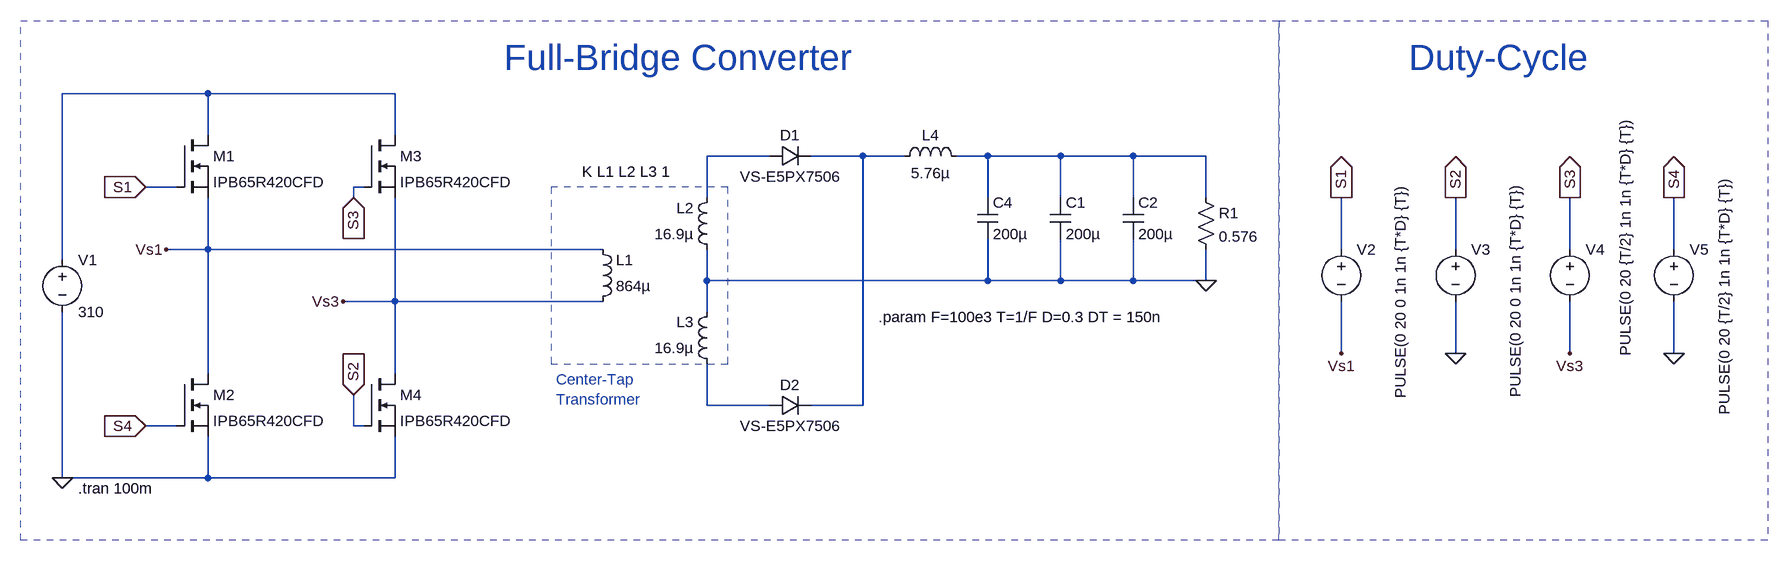
[diagram p0: schematic full_bridge_v1.asc]
full_bridge_v1.asc, the LTspice schematic file:
Version 4.1
SHEET 1 2740 680
WIRE 336 -464 112 -464
WIRE 624 -464 336 -464
WIRE 336 -400 336 -464
WIRE 624 -400 624 -464
WIRE 1200 -368 1104 -368
WIRE 1344 -368 1264 -368
WIRE 1408 -368 1344 -368
WIRE 1536 -368 1488 -368
WIRE 1648 -368 1536 -368
WIRE 1760 -368 1648 -368
WIRE 1872 -368 1760 -368
WIRE 288 -320 240 -320
WIRE 576 -320 560 -320
WIRE 560 -304 560 -320
WIRE 1104 -304 1104 -368
WIRE 1536 -304 1536 -368
WIRE 1648 -304 1648 -368
WIRE 1760 -304 1760 -368
WIRE 1872 -304 1872 -368
WIRE 336 -224 336 -304
WIRE 336 -224 272 -224
WIRE 944 -224 336 -224
WIRE 2080 -224 2080 -304
WIRE 2256 -224 2256 -304
WIRE 2432 -224 2432 -304
WIRE 2592 -224 2592 -304
WIRE 112 -208 112 -464
WIRE 1104 -176 1104 -224
WIRE 1536 -176 1536 -240
WIRE 1536 -176 1104 -176
WIRE 1648 -176 1648 -240
WIRE 1648 -176 1536 -176
WIRE 1760 -176 1760 -240
WIRE 1760 -176 1648 -176
WIRE 1872 -176 1872 -224
WIRE 1872 -176 1760 -176
WIRE 624 -144 624 -304
WIRE 624 -144 544 -144
WIRE 944 -144 624 -144
WIRE 1104 -128 1104 -176
WIRE 2080 -64 2080 -144
WIRE 2256 -64 2256 -144
WIRE 2432 -64 2432 -144
WIRE 2592 -64 2592 -144
WIRE 336 -32 336 -224
WIRE 624 -32 624 -144
WIRE 1104 16 1104 -48
WIRE 1200 16 1104 16
WIRE 1344 16 1344 -368
WIRE 1344 16 1264 16
WIRE 288 48 240 48
WIRE 560 48 560 0
WIRE 576 48 560 48
WIRE 112 128 112 -128
WIRE 336 128 336 64
WIRE 336 128 112 128
WIRE 624 128 624 64
WIRE 624 128 336 128
FLAG 112 128 0
FLAG 240 -320 S1
IOPIN 240 -320 In
FLAG 560 0 S2
IOPIN 560 0 In
FLAG 560 -304 S3
IOPIN 560 -304 In
FLAG 240 48 S4
IOPIN 240 48 In
FLAG 1872 -176 0
FLAG 272 -224 Vs1
FLAG 544 -144 Vs3
FLAG 2080 -64 Vs1
FLAG 2432 -64 Vs3
FLAG 2256 -64 0
FLAG 2592 -64 0
FLAG 2080 -304 S1
IOPIN 2080 -304 Out
FLAG 2256 -304 S2
IOPIN 2256 -304 Out
FLAG 2432 -304 S3
IOPIN 2432 -304 Out
FLAG 2592 -304 S4
IOPIN 2592 -304 Out
SYMBOL voltage 112 -224 R0
WINDOW 123 0 0 Left 0
WINDOW 39 0 0 Left 0
SYMATTR InstName V1
SYMATTR Value 310
SYMBOL nmos 288 -32 R0
SYMATTR InstName M2
SYMATTR Value IPB65R420CFD
SYMBOL nmos 576 -400 R0
SYMATTR InstName M3
SYMATTR Value IPB65R420CFD
SYMBOL nmos 576 -32 R0
SYMATTR InstName M4
SYMATTR Value IPB65R420CFD
SYMBOL ind 928 -128 M180
WINDOW 0 36 80 Left 2
WINDOW 3 36 40 Left 2
SYMATTR InstName L1
SYMATTR Value 864µ
SYMATTR SpiceLine Rser=0.1
SYMBOL ind 1120 -208 R180
WINDOW 0 36 80 Left 2
WINDOW 3 36 40 Left 2
SYMATTR InstName L2
SYMATTR Value 16.9µ
SYMBOL ind 1120 -32 R180
WINDOW 0 36 80 Left 2
WINDOW 3 36 40 Left 2
SYMATTR InstName L3
SYMATTR Value 16.9µ
SYMBOL diode 1200 -352 R270
WINDOW 0 32 32 VTop 2
WINDOW 3 0 32 VBottom 2
SYMATTR InstName D1
SYMATTR Value VS-E5PX7506
SYMBOL diode 1200 32 R270
WINDOW 0 32 32 VTop 2
WINDOW 3 0 32 VBottom 2
SYMATTR InstName D2
SYMATTR Value VS-E5PX7506
SYMBOL ind 1392 -352 R270
WINDOW 0 32 56 VTop 2
WINDOW 3 5 56 VBottom 2
SYMATTR InstName L4
SYMATTR Value 5.76µ
SYMBOL cap 1632 -304 R0
SYMATTR InstName C1
SYMATTR Value 200µ
SYMBOL res 1856 -320 R0
SYMATTR InstName R1
SYMATTR Value 0.576
SYMBOL cap 1744 -304 R0
SYMATTR InstName C2
SYMATTR Value 200µ
SYMBOL voltage 2080 -240 R0
WINDOW 3 91 246 VLeft 2
WINDOW 123 0 0 Left 0
WINDOW 39 0 0 Left 0
SYMATTR Value PULSE(0 20 0 1n 1n {T*D} {T})
SYMATTR InstName V2
SYMBOL voltage 2256 -240 R0
WINDOW 3 92 245 VLeft 2
WINDOW 123 0 0 Left 0
WINDOW 39 0 0 Left 0
SYMATTR Value PULSE(0 20 0 1n 1n {T*D} {T})
SYMATTR InstName V3
SYMBOL voltage 2432 -240 R0
WINDOW 3 85 -190 VRight 2
WINDOW 123 0 0 Left 0
WINDOW 39 0 0 Left 0
SYMATTR Value PULSE(0 20 {T/2} 1n 1n {T*D} {T})
SYMATTR InstName V4
SYMBOL voltage 2592 -240 R0
WINDOW 3 78 271 VLeft 2
WINDOW 123 0 0 Left 0
WINDOW 39 0 0 Left 0
SYMATTR Value PULSE(0 20 {T/2} 1n 1n {T*D} {T})
SYMATTR InstName V5
SYMBOL nmos 288 -400 R0
SYMATTR InstName M1
SYMATTR Value IPB65R420CFD
SYMBOL cap 1520 -304 R0
SYMATTR InstName C4
SYMATTR Value 200µ
TEXT 912 -344 Left 2 !K L1 L2 L3 1
TEXT 1368 -120 Left 2 !.param F=100e3 T=1/F D=0.3 DT = 150n
TEXT 136 144 Left 2 !.tran 100m
TEXT 872 -24 Left 2 ;Center-Tap\nTransformer
TEXT 792 -520 Left 5 ;Full-Bridge Converter
TEXT 2184 -520 Left 5 ;Duty-Cycle
RECTANGLE Normal 864 -48 1136 -320 1
RECTANGLE Normal 1984 224 48 -576 3
RECTANGLE Normal 2736 224 1984 -576 3

The netlist it stands for:
* full_bridge_v1.asc
V1 N001 0 310
M2 Vs1 S4 0 0 IPB65R420CFD
M3 N001 S3 Vs3 Vs3 IPB65R420CFD
M4 Vs3 S2 0 0 IPB65R420CFD
L1 Vs3 Vs1 864µ Rser=0.1
L2 0 N002 16.9µ
L3 N005 0 16.9µ
D1 N002 N003 VS-E5PX7506
D2 N005 N003 VS-E5PX7506
L4 N003 N004 5.76µ
C1 N004 0 200µ
R1 N004 0 0.576
C2 N004 0 200µ
V2 S1 Vs1 PULSE(0 20 0 1n 1n {T*D} {T})
V3 S2 0 PULSE(0 20 0 1n 1n {T*D} {T})
V4 S3 Vs3 PULSE(0 20 {T/2} 1n 1n {T*D} {T})
V5 S4 0 PULSE(0 20 {T/2} 1n 1n {T*D} {T})
M1 N001 S1 Vs1 Vs1 IPB65R420CFD
C4 N004 0 200µ
.model D D
.lib standard.dio
.model NMOS NMOS
.model PMOS PMOS
.lib standard.mos
K L1 L2 L3 1
.param F=100e3 T=1/F D=0.3 DT = 150n
.tran 100m
* Center-Tap
* Transformer
* Full-Bridge Converter
* Duty-Cycle
.backanno
.end